# Altium schematic sheet Li-Ion ChargeProtectBoost.SchDoc
size A
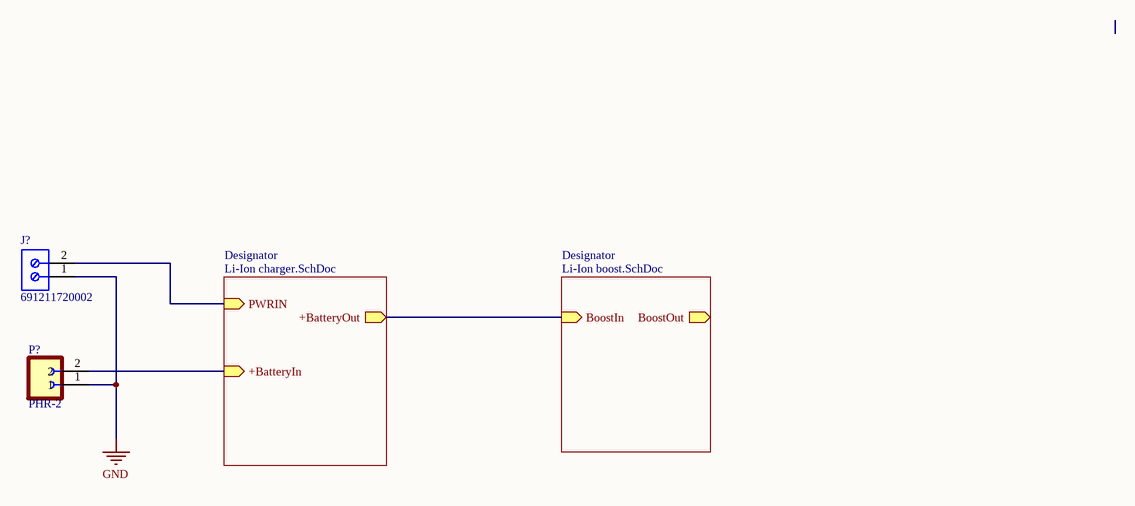
[diagram p0: Li-Ion ChargeProtectBoost.SchDoc]

## Parts
J?  691211720002  [691211720002]
P?  PHR-2  [JST_PHR-2]

## Sub-sheets
Designator = Li-Ion charger.SchDoc: +BatteryIn (in), PWRIN (in), +BatteryOut (out)
Designator = Li-Ion boost.SchDoc: BoostOut (out), BoostIn (in)

## Nets
GND: J?.1 P?.1
NetJ?_2: J?.2 ; sheet Designator/PWRIN
NetP?_2: P?.2 ; sheet Designator/+BatteryIn
(unnamed): sheet Designator/+BatteryOut, sheet Designator/BoostIn

## Library data of the parts
J? = CMP-1502-02524-1: Serie 211 - 5.00 mm 45deg Entry Modular with Rising Cage Clamp - 15.50 mm Height WR-TBL, 2 pin; Manufacturer: Wurth Elektronik; Pitch: 5.00mm; Pin Number: 2; Manufacturer URL: http://www.we-online.de; Mounting Technology: THT; Packaging: Box; Datasheet URL: http://katalog.we-online.de/em/datasheet/6912117200xx.pdf; Operating Temperature: -40to105degC; Package Reference: 691211720002; Part Number: 691211720002; Publisher: WurthElektronik
P? = PHR-2: PH Series 2 Position 2 mm Pitch Free Hanging Housing Connector; Value: *; MP: PHR-2; Package: None; Availability: Unavailable; Price: None